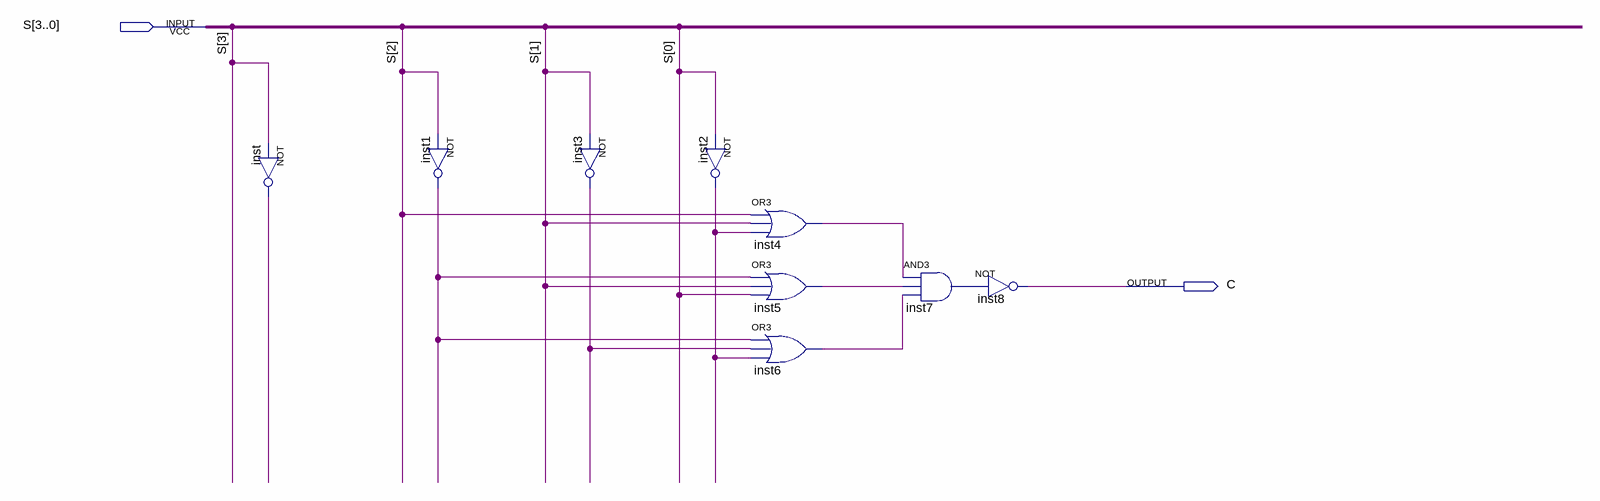
[diagram p0: schematic sheet]
// Quartus schematic DisplayC.bdf as structural Verilog: 9 symbols, 2 pins
module DisplayC (
  input  [3:0] S,
  output C
);

  wire inst1_out, inst2_out, inst3_out, inst4_out, inst5_out, inst6_out, inst7_out, inst_out;

  not inst (inst_out, S[3]);
  not inst1 (inst1_out, S[2]);
  not inst3 (inst3_out, S[1]);
  not inst2 (inst2_out, S[0]);
  or inst4 (inst4_out, S[2], S[1], inst2_out);
  or inst5 (inst5_out, inst1_out, S[1], S[0]);
  or inst6 (inst6_out, inst1_out, inst3_out, inst2_out);
  and inst7 (inst7_out, inst4_out, inst5_out, inst6_out);
  not inst8 (C, inst7_out);
endmodule
